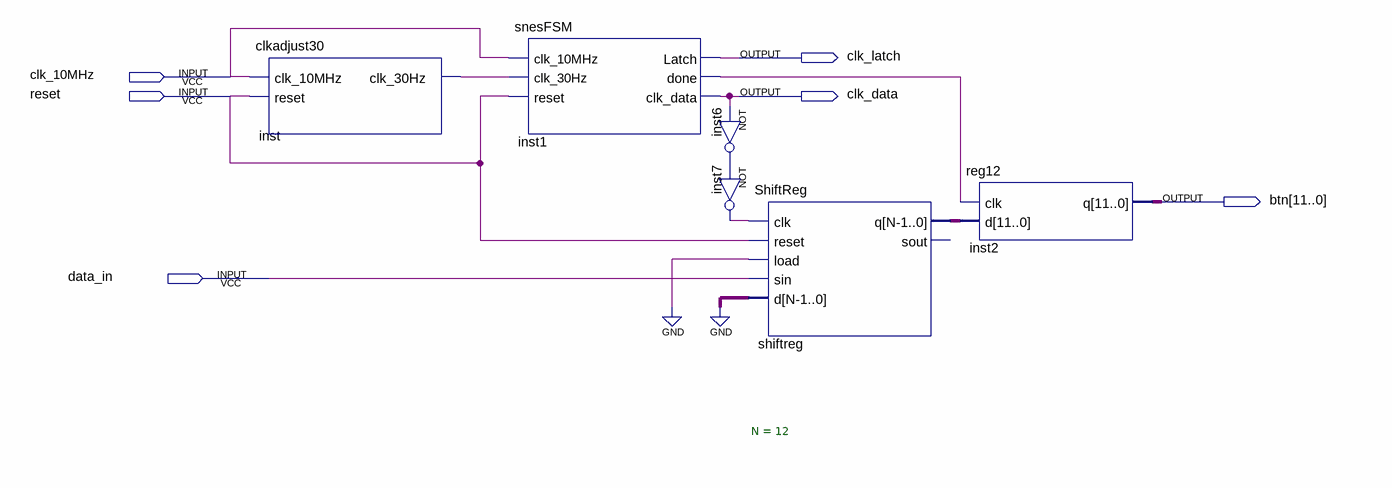
[diagram p0: schematic sheet]
// Quartus schematic snesdecoder.bdf as structural Verilog: 6 symbols, 6 pins
module snesdecoder (
  input  clk_10MHz,
  input  reset,
  input  data_in,
  output clk_latch,
  output clk_data,
  output [11:0] btn
);

  wire inst1_done, inst6_out, inst7_out, inst_clk_30hz;
  wire [11:0] shiftreg_q;

  clkadjust30 inst (.clk_10MHz(clk_10MHz), .reset(reset), .clk_30Hz(inst_clk_30hz));
  snesFSM inst1 (
    .clk_10MHz(clk_10MHz), .clk_30Hz(inst_clk_30hz), .reset(reset), .Latch(clk_latch), .done(inst1_done),
    .clk_data(clk_data));
  not inst6 (inst6_out, clk_data);
  not inst7 (inst7_out, inst6_out);
  ShiftReg #(.N(12)) shiftreg (
    .clk(inst7_out), .reset(reset), .load(1'b0), .sin(data_in), .d({12{1'b0}}), .q(shiftreg_q));  // open: sout
  reg12 inst2 (.clk(inst1_done), .d(shiftreg_q), .q(btn));
endmodule
